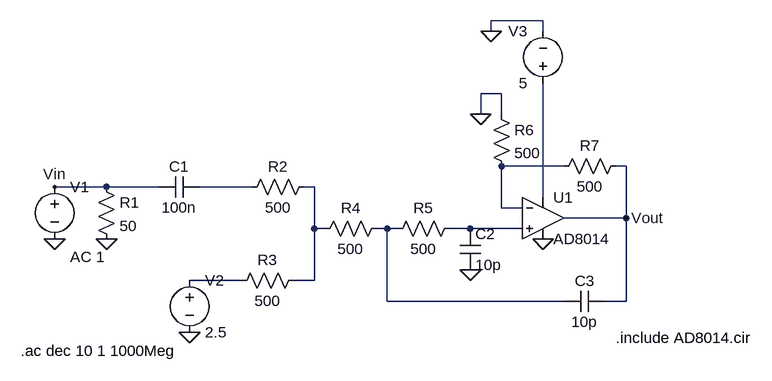
[diagram p0: schematic amp.asc]
amp.asc, the LTspice schematic file:
Version 4
SHEET 1 1072 680
WIRE 736 0 656 0
WIRE 656 16 656 0
WIRE 736 16 736 0
WIRE 672 112 640 112
WIRE 640 144 640 112
WIRE 672 144 672 112
WIRE 768 224 672 224
WIRE 864 224 848 224
WIRE 64 256 -16 256
WIRE 144 256 64 256
WIRE 288 256 208 256
WIRE 384 256 368 256
WIRE 736 272 736 96
WIRE 672 288 672 224
WIRE 704 288 672 288
WIRE 864 304 864 224
WIRE 864 304 768 304
WIRE 384 320 384 256
WIRE 400 320 384 320
WIRE 496 320 480 320
WIRE 512 320 496 320
WIRE 624 320 592 320
WIRE 704 320 624 320
WIRE 272 400 192 400
WIRE 384 400 384 320
WIRE 384 400 352 400
WIRE 496 432 496 320
WIRE 768 432 496 432
WIRE 864 432 864 304
WIRE 864 432 832 432
FLAG -16 336 0
FLAG 192 480 0
FLAG 64 336 0
FLAG 624 384 0
FLAG 640 144 0
FLAG 736 336 0
FLAG 656 16 0
FLAG -16 256 Vin
FLAG 864 304 Vout
SYMBOL res 48 240 R0
SYMATTR InstName R1
SYMATTR Value 50
SYMBOL voltage -16 240 R0
WINDOW 123 24 124 Left 2
WINDOW 39 0 0 Left 0
SYMATTR InstName V1
SYMATTR Value ""
SYMATTR Value2 AC 1
SYMBOL voltage 192 384 R0
WINDOW 123 0 0 Left 0
WINDOW 39 0 0 Left 0
SYMATTR InstName V2
SYMATTR Value 2.5
SYMBOL cap 208 240 R90
WINDOW 0 0 32 VBottom 2
WINDOW 3 32 32 VTop 2
SYMATTR InstName C1
SYMATTR Value 100n
SYMBOL res 384 240 R90
WINDOW 0 0 56 VBottom 2
WINDOW 3 32 56 VTop 2
SYMATTR InstName R2
SYMATTR Value 500
SYMBOL res 368 384 R90
WINDOW 0 0 56 VBottom 2
WINDOW 3 32 56 VTop 2
SYMATTR InstName R3
SYMATTR Value 500
SYMBOL res 496 304 R90
WINDOW 0 0 56 VBottom 2
WINDOW 3 32 56 VTop 2
SYMATTR InstName R4
SYMATTR Value 500
SYMBOL res 608 304 R90
WINDOW 0 0 56 VBottom 2
WINDOW 3 32 56 VTop 2
SYMATTR InstName R5
SYMATTR Value 500
SYMBOL cap 608 320 R0
SYMATTR InstName C2
SYMATTR Value 10p
SYMBOL Opamps\\opamp2 736 240 R0
SYMATTR InstName U1
SYMATTR Value AD8014
SYMBOL res 656 128 R0
SYMATTR InstName R6
SYMATTR Value 500
SYMBOL res 864 208 R90
WINDOW 0 0 56 VBottom 2
WINDOW 3 32 56 VTop 2
SYMATTR InstName R7
SYMATTR Value 500
SYMBOL cap 832 416 R90
WINDOW 0 0 32 VBottom 2
WINDOW 3 32 32 VTop 2
SYMATTR InstName C3
SYMATTR Value 10p
SYMBOL voltage 736 112 R180
WINDOW 0 24 96 Left 2
WINDOW 3 24 16 Left 2
WINDOW 123 0 0 Left 0
WINDOW 39 0 0 Left 0
SYMATTR InstName V3
SYMATTR Value 5
TEXT 848 488 Left 2 !.include AD8014.cir
TEXT -68 508 Left 2 !.ac dec 10 1 1000Meg

The netlist it stands for:
* amp.asc
R1 Vin 0 50
V1 Vin 0 AC 1
V2 N007 0 2.5
C1 N002 Vin 100n
R2 N003 N002 500
R3 N003 N007 500
R4 N005 N003 500
R5 N006 N005 500
C2 N006 0 10p
XU1 N006 N001 N004 0 Vout AD8014  ; pins In+ In- V+ V- OUT
R6 0 N001 500
R7 Vout N001 500
C3 Vout N005 10p
V3 N004 0 5
.include AD8014.cir
.ac dec 10 1 1000Meg
.backanno
.end